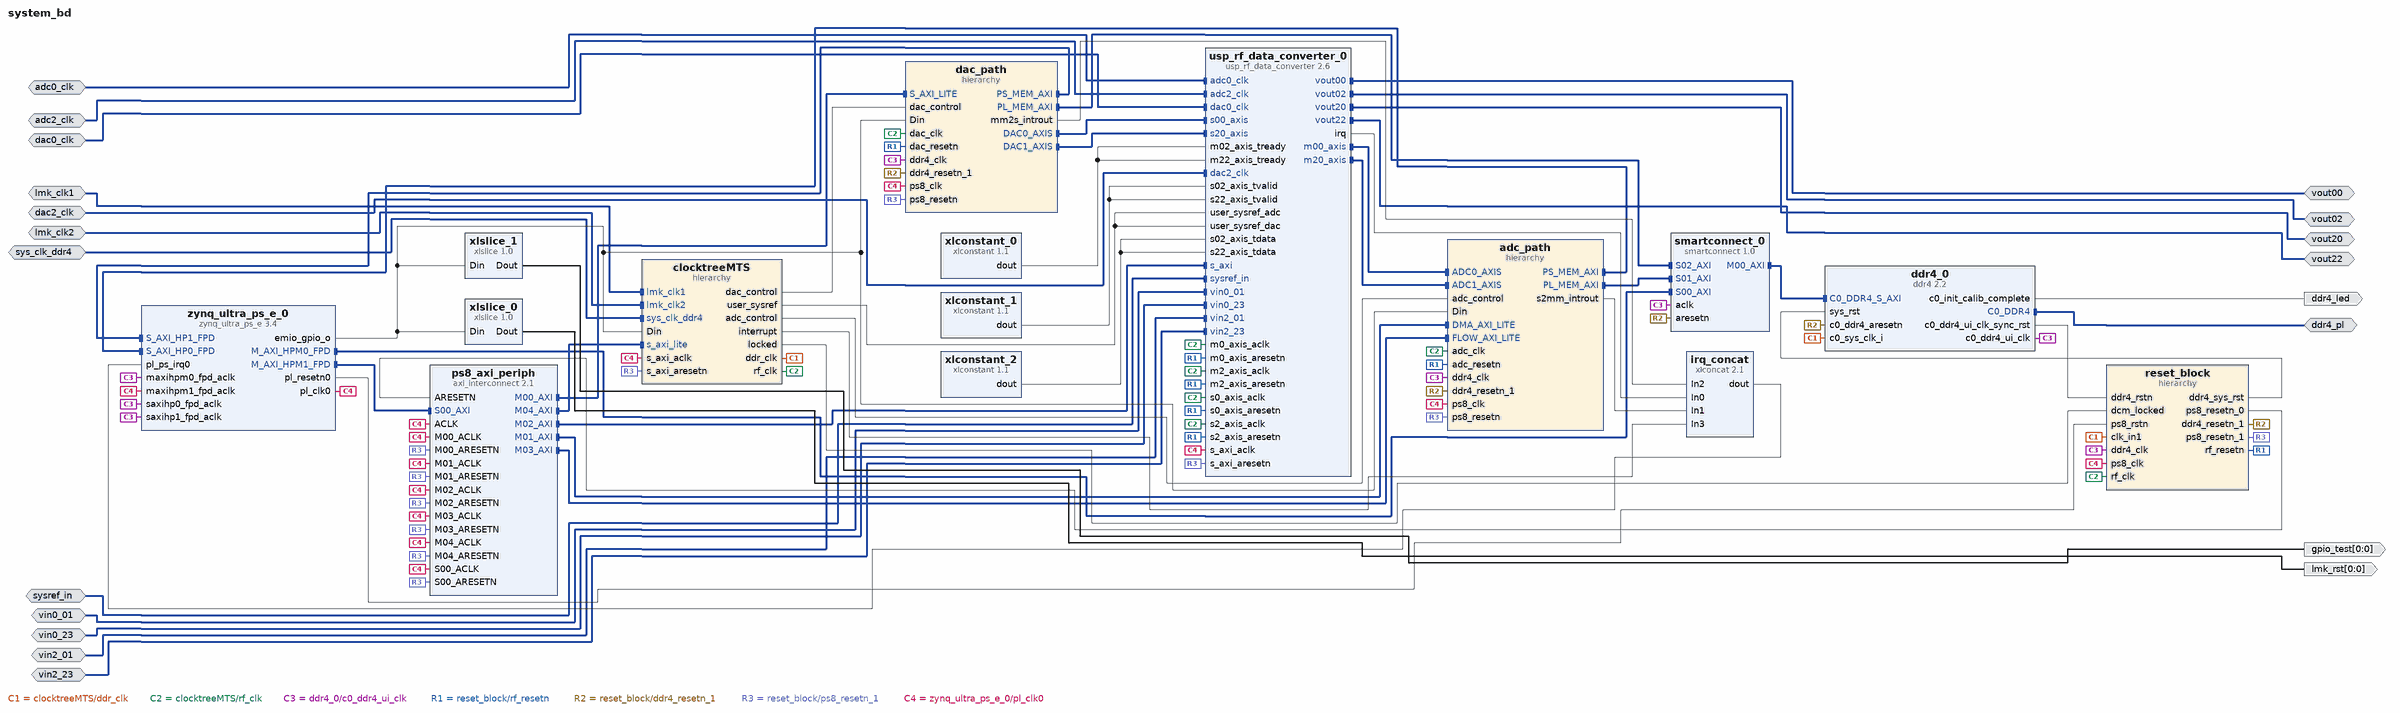
[diagram p0: block diagram of the top level]
# Vivado block design system_bd, xczu48dr-ffvg1517-2-e, Vivado 2022.1
create_bd_design system_bd

create_bd_intf_port -mode Master -vlnv xilinx.com:interface:ddr4_rtl:1.0 ddr4_pl
create_bd_intf_port -mode Slave -vlnv xilinx.com:interface:diff_clock_rtl:1.0 lmk_clk1
set_property -dict {CONFIG.FREQ_HZ 122880000} [get_bd_intf_ports lmk_clk1]
create_bd_intf_port -mode Slave -vlnv xilinx.com:interface:diff_clock_rtl:1.0 lmk_clk2
set_property -dict {CONFIG.FREQ_HZ 7680000} [get_bd_intf_ports lmk_clk2]
create_bd_intf_port -mode Slave -vlnv xilinx.com:interface:diff_clock_rtl:1.0 sys_clk_ddr4
set_property -dict {CONFIG.FREQ_HZ 200000000} [get_bd_intf_ports sys_clk_ddr4]
create_bd_intf_port -mode Slave -vlnv xilinx.com:display_usp_rf_data_converter:diff_pins_rtl:1.0 sysref_in
create_bd_intf_port -mode Slave -vlnv xilinx.com:interface:diff_clock_rtl:1.0 adc0_clk
set_property -dict {CONFIG.FREQ_HZ 100000000} [get_bd_intf_ports adc0_clk]
create_bd_intf_port -mode Slave -vlnv xilinx.com:interface:diff_analog_io_rtl:1.0 vin0_01
create_bd_intf_port -mode Slave -vlnv xilinx.com:interface:diff_analog_io_rtl:1.0 vin0_23
create_bd_intf_port -mode Slave -vlnv xilinx.com:interface:diff_clock_rtl:1.0 adc2_clk
set_property -dict {CONFIG.FREQ_HZ 100000000} [get_bd_intf_ports adc2_clk]
create_bd_intf_port -mode Slave -vlnv xilinx.com:interface:diff_analog_io_rtl:1.0 vin2_01
create_bd_intf_port -mode Slave -vlnv xilinx.com:interface:diff_analog_io_rtl:1.0 vin2_23
create_bd_intf_port -mode Slave -vlnv xilinx.com:interface:diff_clock_rtl:1.0 dac0_clk
set_property -dict {CONFIG.FREQ_HZ 100000000} [get_bd_intf_ports dac0_clk]
create_bd_intf_port -mode Master -vlnv xilinx.com:interface:diff_analog_io_rtl:1.0 vout00
create_bd_intf_port -mode Master -vlnv xilinx.com:interface:diff_analog_io_rtl:1.0 vout02
create_bd_intf_port -mode Slave -vlnv xilinx.com:interface:diff_clock_rtl:1.0 dac2_clk
set_property -dict {CONFIG.FREQ_HZ 100000000} [get_bd_intf_ports dac2_clk]
create_bd_intf_port -mode Master -vlnv xilinx.com:interface:diff_analog_io_rtl:1.0 vout20
create_bd_intf_port -mode Master -vlnv xilinx.com:interface:diff_analog_io_rtl:1.0 vout22
create_bd_port -dir O ddr4_led
create_bd_port -dir O -from 0 -to 0 gpio_test
create_bd_port -dir O -from 0 -to 0 lmk_rst

create_bd_cell -type hier adc_path
create_bd_cell -type hier clocktreeMTS
create_bd_cell -type hier dac_path
create_bd_cell -type hier reset_block
create_bd_cell -type ip -vlnv xilinx.com:ip:ddr4:2.2 ddr4_0
set_property -dict [list \
  CONFIG.C0.BANK_GROUP_WIDTH 1 \
  CONFIG.C0.DDR4_AxiAddressWidth 33 \
  CONFIG.C0.DDR4_AxiDataWidth 512 \
  CONFIG.C0.DDR4_CasLatency 17 \
  CONFIG.C0.DDR4_CasWriteLatency 12 \
  CONFIG.C0.DDR4_DataWidth 64 \
  CONFIG.C0.DDR4_InputClockPeriod 4998 \
  CONFIG.C0.DDR4_MemoryPart MT40A1G16RC-062E \
  CONFIG.C0.DDR4_TimePeriod 833 \
  CONFIG.RESET_BOARD_INTERFACE Custom \
  CONFIG.System_Clock No_Buffer \
] [get_bd_cells ddr4_0]
create_bd_cell -type ip -vlnv xilinx.com:ip:xlconcat:2.1 irq_concat
set_property -dict {CONFIG.NUM_PORTS 4 CONFIG.dout_width 4} [get_bd_cells irq_concat]
create_bd_cell -type ip -vlnv xilinx.com:ip:axi_interconnect:2.1 ps8_axi_periph
set_property -dict {CONFIG.NUM_MI 5} [get_bd_cells ps8_axi_periph]
create_bd_cell -type ip -vlnv xilinx.com:ip:smartconnect:1.0 smartconnect_0
set_property -dict {CONFIG.NUM_SI 3} [get_bd_cells smartconnect_0]
create_bd_cell -type ip -vlnv xilinx.com:ip:usp_rf_data_converter:2.6 usp_rf_data_converter_0
set_property -dict [list \
  CONFIG.ADC0_Multi_Tile_Sync true \
  CONFIG.ADC0_Outclk_Freq 245.760 \
  CONFIG.ADC0_Refclk_Freq 3932.160 \
  CONFIG.ADC0_Sampling_Rate 3.93216 \
  CONFIG.ADC2_Multi_Tile_Sync true \
  CONFIG.ADC_Data_Width00 4 \
  CONFIG.ADC_Data_Width02 4 \
  CONFIG.ADC_Data_Width20 4 \
  CONFIG.ADC_Data_Width22 4 \
  CONFIG.ADC_Decimation_Mode00 4 \
  CONFIG.ADC_Decimation_Mode02 4 \
  CONFIG.ADC_Decimation_Mode20 4 \
  CONFIG.ADC_Decimation_Mode22 4 \
  CONFIG.ADC_Mixer_Type02 1 \
  CONFIG.ADC_Mixer_Type20 1 \
  CONFIG.ADC_Mixer_Type22 1 \
  CONFIG.ADC_OBS22 false \
  CONFIG.ADC_Slice02_Enable true \
  CONFIG.ADC_Slice20_Enable true \
  CONFIG.ADC_Slice22_Enable true \
  CONFIG.DAC0_Multi_Tile_Sync true \
  CONFIG.DAC2_Multi_Tile_Sync true \
  CONFIG.DAC2_Outclk_Freq 245.760 \
  CONFIG.DAC2_Refclk_Freq 3932.160 \
  CONFIG.DAC2_Sampling_Rate 3.93216 \
  CONFIG.DAC_Coarse_Mixer_Freq20 3 \
  CONFIG.DAC_Coarse_Mixer_Freq22 3 \
  CONFIG.DAC_Data_Width00 4 \
  CONFIG.DAC_Data_Width02 4 \
  CONFIG.DAC_Data_Width20 4 \
  CONFIG.DAC_Data_Width22 4 \
  CONFIG.DAC_Interpolation_Mode00 4 \
  CONFIG.DAC_Interpolation_Mode02 4 \
  CONFIG.DAC_Interpolation_Mode20 4 \
  CONFIG.DAC_Interpolation_Mode22 4 \
  CONFIG.DAC_Mixer_Type00 1 \
  CONFIG.DAC_Mixer_Type02 1 \
  CONFIG.DAC_Mixer_Type20 1 \
  CONFIG.DAC_Mixer_Type22 1 \
  CONFIG.DAC_Slice00_Enable true \
  CONFIG.DAC_Slice02_Enable true \
  CONFIG.DAC_Slice20_Enable true \
  CONFIG.DAC_Slice22_Enable true \
] [get_bd_cells usp_rf_data_converter_0]
create_bd_cell -type ip -vlnv xilinx.com:ip:xlconstant:1.1 xlconstant_0
create_bd_cell -type ip -vlnv xilinx.com:ip:xlconstant:1.1 xlconstant_1
create_bd_cell -type ip -vlnv xilinx.com:ip:xlconstant:1.1 xlconstant_2
set_property -dict {CONFIG.CONST_VAL 0 CONFIG.CONST_WIDTH 64} [get_bd_cells xlconstant_2]
create_bd_cell -type ip -vlnv xilinx.com:ip:xlslice:1.0 xlslice_0
set_property -dict {CONFIG.DIN_FROM 84 CONFIG.DIN_TO 84 CONFIG.DIN_WIDTH 95 CONFIG.DOUT_WIDTH 1} [get_bd_cells xlslice_0]
create_bd_cell -type ip -vlnv xilinx.com:ip:xlslice:1.0 xlslice_1
set_property -dict {CONFIG.DIN_FROM 80 CONFIG.DIN_TO 80 CONFIG.DIN_WIDTH 95 CONFIG.DOUT_WIDTH 1} [get_bd_cells xlslice_1]
create_bd_cell -type ip -vlnv xilinx.com:ip:zynq_ultra_ps_e:3.4 zynq_ultra_ps_e_0
set_property -dict [list \
  CONFIG.CAN0_BOARD_INTERFACE custom \
  CONFIG.CAN1_BOARD_INTERFACE custom \
  CONFIG.CSU_BOARD_INTERFACE custom \
  CONFIG.DP_BOARD_INTERFACE custom \
  CONFIG.GEM0_BOARD_INTERFACE custom \
  CONFIG.GEM1_BOARD_INTERFACE custom \
  CONFIG.GEM2_BOARD_INTERFACE custom \
  CONFIG.GEM3_BOARD_INTERFACE custom \
  CONFIG.GPIO_BOARD_INTERFACE custom \
  CONFIG.IIC0_BOARD_INTERFACE custom \
  CONFIG.IIC1_BOARD_INTERFACE custom \
  CONFIG.NAND_BOARD_INTERFACE custom \
  CONFIG.PCIE_BOARD_INTERFACE custom \
  CONFIG.PJTAG_BOARD_INTERFACE custom \
  CONFIG.PMU_BOARD_INTERFACE custom \
  CONFIG.PSU_BANK_0_IO_STANDARD LVCMOS33 \
  CONFIG.PSU_BANK_1_IO_STANDARD LVCMOS18 \
  CONFIG.PSU_BANK_2_IO_STANDARD LVCMOS18 \
  CONFIG.PSU_BANK_3_IO_STANDARD LVCMOS18 \
  CONFIG.PSU_USB3__DUAL_CLOCK_ENABLE 1 \
  CONFIG.PSU__CAN1__PERIPHERAL__ENABLE 0 \
  CONFIG.PSU__CRF_APB__ACPU_CTRL__FREQMHZ 1200 \
  CONFIG.PSU__CRF_APB__ACPU_CTRL__SRCSEL APLL \
  CONFIG.PSU__CRF_APB__APLL_CTRL__SRCSEL PSS_REF_CLK \
  CONFIG.PSU__CRF_APB__DBG_FPD_CTRL__FREQMHZ 250 \
  CONFIG.PSU__CRF_APB__DBG_FPD_CTRL__SRCSEL IOPLL \
  CONFIG.PSU__CRF_APB__DBG_TRACE_CTRL__FREQMHZ 250 \
  CONFIG.PSU__CRF_APB__DBG_TRACE_CTRL__SRCSEL IOPLL \
  CONFIG.PSU__CRF_APB__DBG_TSTMP_CTRL__FREQMHZ 250 \
  CONFIG.PSU__CRF_APB__DBG_TSTMP_CTRL__SRCSEL IOPLL \
  CONFIG.PSU__CRF_APB__DDR_CTRL__FREQMHZ 1200 \
  CONFIG.PSU__CRF_APB__DDR_CTRL__SRCSEL DPLL \
  CONFIG.PSU__CRF_APB__DPDMA_REF_CTRL__FREQMHZ 600 \
  CONFIG.PSU__CRF_APB__DPDMA_REF_CTRL__SRCSEL DPLL \
  CONFIG.PSU__CRF_APB__DPLL_CTRL__SRCSEL PSS_REF_CLK \
  CONFIG.PSU__CRF_APB__DP_AUDIO_REF_CTRL__SRCSEL VPLL \
  CONFIG.PSU__CRF_APB__DP_STC_REF_CTRL__SRCSEL VPLL \
  CONFIG.PSU__CRF_APB__DP_VIDEO_REF_CTRL__SRCSEL DPLL \
  CONFIG.PSU__CRF_APB__GDMA_REF_CTRL__FREQMHZ 600 \
  CONFIG.PSU__CRF_APB__GDMA_REF_CTRL__SRCSEL DPLL \
  CONFIG.PSU__CRF_APB__GPU_REF_CTRL__FREQMHZ 600 \
  CONFIG.PSU__CRF_APB__GPU_REF_CTRL__SRCSEL DPLL \
  CONFIG.PSU__CRF_APB__TOPSW_LSBUS_CTRL__FREQMHZ 100 \
  CONFIG.PSU__CRF_APB__TOPSW_LSBUS_CTRL__SRCSEL IOPLL \
  CONFIG.PSU__CRF_APB__TOPSW_MAIN_CTRL__FREQMHZ 533.333 \
  CONFIG.PSU__CRF_APB__TOPSW_MAIN_CTRL__SRCSEL VPLL \
  CONFIG.PSU__CRF_APB__VPLL_CTRL__SRCSEL PSS_REF_CLK \
  CONFIG.PSU__CRL_APB__ADMA_REF_CTRL__FREQMHZ 533.333 \
  CONFIG.PSU__CRL_APB__ADMA_REF_CTRL__SRCSEL RPLL \
  CONFIG.PSU__CRL_APB__CAN1_REF_CTRL__FREQMHZ 100 \
  CONFIG.PSU__CRL_APB__CAN1_REF_CTRL__SRCSEL IOPLL \
  CONFIG.PSU__CRL_APB__CPU_R5_CTRL__FREQMHZ 500 \
  CONFIG.PSU__CRL_APB__CPU_R5_CTRL__SRCSEL IOPLL \
  CONFIG.PSU__CRL_APB__DBG_LPD_CTRL__FREQMHZ 250 \
  CONFIG.PSU__CRL_APB__DBG_LPD_CTRL__SRCSEL IOPLL \
  CONFIG.PSU__CRL_APB__GEM3_REF_CTRL__FREQMHZ 125 \
  CONFIG.PSU__CRL_APB__GEM3_REF_CTRL__SRCSEL IOPLL \
  CONFIG.PSU__CRL_APB__I2C0_REF_CTRL__FREQMHZ 100 \
  CONFIG.PSU__CRL_APB__I2C0_REF_CTRL__SRCSEL IOPLL \
  CONFIG.PSU__CRL_APB__I2C1_REF_CTRL__FREQMHZ 100 \
  CONFIG.PSU__CRL_APB__I2C1_REF_CTRL__SRCSEL IOPLL \
  CONFIG.PSU__CRL_APB__IOPLL_CTRL__SRCSEL PSS_REF_CLK \
  CONFIG.PSU__CRL_APB__IOU_SWITCH_CTRL__FREQMHZ 267 \
  CONFIG.PSU__CRL_APB__IOU_SWITCH_CTRL__SRCSEL RPLL \
  CONFIG.PSU__CRL_APB__LPD_LSBUS_CTRL__FREQMHZ 100 \
  CONFIG.PSU__CRL_APB__LPD_LSBUS_CTRL__SRCSEL IOPLL \
  CONFIG.PSU__CRL_APB__LPD_SWITCH_CTRL__FREQMHZ 533.333 \
  CONFIG.PSU__CRL_APB__LPD_SWITCH_CTRL__SRCSEL RPLL \
  CONFIG.PSU__CRL_APB__PCAP_CTRL__FREQMHZ 200 \
  CONFIG.PSU__CRL_APB__PCAP_CTRL__SRCSEL IOPLL \
  CONFIG.PSU__CRL_APB__PL0_REF_CTRL__FREQMHZ 100 \
  CONFIG.PSU__CRL_APB__PL0_REF_CTRL__SRCSEL IOPLL \
  CONFIG.PSU__CRL_APB__QSPI_REF_CTRL__FREQMHZ 300 \
  CONFIG.PSU__CRL_APB__QSPI_REF_CTRL__SRCSEL IOPLL \
  CONFIG.PSU__CRL_APB__RPLL_CTRL__SRCSEL PSS_REF_CLK \
  CONFIG.PSU__CRL_APB__SDIO1_REF_CTRL__FREQMHZ 200 \
  CONFIG.PSU__CRL_APB__SDIO1_REF_CTRL__SRCSEL IOPLL \
  CONFIG.PSU__CRL_APB__TIMESTAMP_REF_CTRL__FREQMHZ 100 \
  CONFIG.PSU__CRL_APB__TIMESTAMP_REF_CTRL__SRCSEL PSS_REF_CLK \
  CONFIG.PSU__CRL_APB__UART0_REF_CTRL__FREQMHZ 100 \
  CONFIG.PSU__CRL_APB__UART0_REF_CTRL__SRCSEL IOPLL \
  CONFIG.PSU__CRL_APB__UART1_REF_CTRL__FREQMHZ 100 \
  CONFIG.PSU__CRL_APB__UART1_REF_CTRL__SRCSEL IOPLL \
  CONFIG.PSU__CRL_APB__USB0_BUS_REF_CTRL__FREQMHZ 250 \
  CONFIG.PSU__CRL_APB__USB0_BUS_REF_CTRL__SRCSEL IOPLL \
  CONFIG.PSU__CRL_APB__USB3_DUAL_REF_CTRL__FREQMHZ 20 \
  CONFIG.PSU__CRL_APB__USB3_DUAL_REF_CTRL__SRCSEL IOPLL \
  CONFIG.PSU__CRL_APB__USB3__ENABLE 1 \
  CONFIG.PSU__CSUPMU__PERIPHERAL__VALID 0 \
  CONFIG.PSU__DDRC__BUS_WIDTH {64 Bit} \
  CONFIG.PSU__DDRC__COMPONENTS Components \
  CONFIG.PSU__DDRC__DEVICE_CAPACITY {16384 MBits} \
  CONFIG.PSU__DDRC__DRAM_WIDTH {16 Bits} \
  CONFIG.PSU__DDRC__ECC Disabled \
  CONFIG.PSU__DDRC__MEMORY_TYPE {DDR 4} \
  CONFIG.PSU__DDRC__SPEED_BIN DDR4_2400R \
  CONFIG.PSU__DDR_HIGH_ADDRESS_GUI_ENABLE 1 \
  CONFIG.PSU__DDR__INTERFACE__FREQMHZ 600.000 \
  CONFIG.PSU__DEVICE_TYPE RFSOC \
  CONFIG.PSU__DISPLAYPORT__PERIPHERAL__ENABLE 0 \
  CONFIG.PSU__DLL__ISUSED 1 \
  CONFIG.PSU__ENET0__GRP_MDIO__ENABLE 1 \
  CONFIG.PSU__ENET0__GRP_MDIO__IO {MIO 76 .. 77} \
  CONFIG.PSU__ENET0__PERIPHERAL__ENABLE 1 \
  CONFIG.PSU__ENET0__PERIPHERAL__IO {MIO 26 .. 37} \
  CONFIG.PSU__ENET3__PERIPHERAL__ENABLE 0 \
  CONFIG.PSU__FPD_SLCR__WDT1__FREQMHZ 100 \
  CONFIG.PSU__FPGA_PL0_ENABLE 1 \
  CONFIG.PSU__GEM__TSU__ENABLE 0 \
  CONFIG.PSU__GPIO0_MIO__IO {MIO 0 .. 25} \
  CONFIG.PSU__GPIO0_MIO__PERIPHERAL__ENABLE 1 \
  CONFIG.PSU__GPIO1_MIO__IO {MIO 26 .. 51} \
  CONFIG.PSU__GPIO1_MIO__PERIPHERAL__ENABLE 1 \
  CONFIG.PSU__GPIO_EMIO_WIDTH 95 \
  CONFIG.PSU__GPIO_EMIO__PERIPHERAL__ENABLE 1 \
  CONFIG.PSU__GPIO_EMIO__PERIPHERAL__IO 95 \
  CONFIG.PSU__GPU_PP0__POWER__ON 0 \
  CONFIG.PSU__GPU_PP1__POWER__ON 0 \
  CONFIG.PSU__I2C0__PERIPHERAL__ENABLE 1 \
  CONFIG.PSU__I2C0__PERIPHERAL__IO {MIO 14 .. 15} \
  CONFIG.PSU__I2C1__PERIPHERAL__ENABLE 1 \
  CONFIG.PSU__I2C1__PERIPHERAL__IO {MIO 16 .. 17} \
  CONFIG.PSU__IOU_SLCR__IOU_TTC_APB_CLK__TTC0_SEL APB \
  CONFIG.PSU__IOU_SLCR__IOU_TTC_APB_CLK__TTC1_SEL APB \
  CONFIG.PSU__IOU_SLCR__IOU_TTC_APB_CLK__TTC2_SEL APB \
  CONFIG.PSU__IOU_SLCR__IOU_TTC_APB_CLK__TTC3_SEL APB \
  CONFIG.PSU__IOU_SLCR__TTC0__FREQMHZ 100 \
  CONFIG.PSU__IOU_SLCR__TTC1__FREQMHZ 100 \
  CONFIG.PSU__IOU_SLCR__TTC2__FREQMHZ 100 \
  CONFIG.PSU__IOU_SLCR__TTC3__FREQMHZ 100 \
  CONFIG.PSU__IOU_SLCR__WDT0__FREQMHZ 100 \
  CONFIG.PSU__LPD_SLCR__CSUPMU__FREQMHZ 100 \
  CONFIG.PSU__MAXIGP0__DATA_WIDTH 128 \
  CONFIG.PSU__OVERRIDE_HPX_QOS 0 \
  CONFIG.PSU__OVERRIDE__BASIC_CLOCK 0 \
  CONFIG.PSU__PMU__PERIPHERAL__ENABLE 0 \
  CONFIG.PSU__PRESET_APPLIED 0 \
  CONFIG.PSU__PSS_REF_CLK__FREQMHZ 33.333 \
  CONFIG.PSU__QSPI_COHERENCY 0 \
  CONFIG.PSU__QSPI_ROUTE_THROUGH_FPD 0 \
  CONFIG.PSU__QSPI__GRP_FBCLK__ENABLE 0 \
  CONFIG.PSU__QSPI__PERIPHERAL__DATA_MODE x1 \
  CONFIG.PSU__QSPI__PERIPHERAL__ENABLE 1 \
  CONFIG.PSU__QSPI__PERIPHERAL__IO {MIO 0 .. 5} \
  CONFIG.PSU__QSPI__PERIPHERAL__MODE Single \
  CONFIG.PSU__SATA__PERIPHERAL__ENABLE 0 \
  CONFIG.PSU__SD0__CLK_100_SDR_OTAP_DLY 0x3 \
  CONFIG.PSU__SD0__CLK_200_SDR_OTAP_DLY 0x3 \
  CONFIG.PSU__SD0__CLK_50_DDR_ITAP_DLY 0x3D \
  CONFIG.PSU__SD0__CLK_50_DDR_OTAP_DLY 0x4 \
  CONFIG.PSU__SD0__CLK_50_SDR_ITAP_DLY 0x15 \
  CONFIG.PSU__SD0__CLK_50_SDR_OTAP_DLY 0x5 \
  CONFIG.PSU__SD1_COHERENCY 0 \
  CONFIG.PSU__SD1_ROUTE_THROUGH_FPD 0 \
  CONFIG.PSU__SD1__CLK_100_SDR_OTAP_DLY 0x3 \
  CONFIG.PSU__SD1__CLK_200_SDR_OTAP_DLY 0x3 \
  CONFIG.PSU__SD1__CLK_50_DDR_ITAP_DLY 0x3D \
  CONFIG.PSU__SD1__CLK_50_DDR_OTAP_DLY 0x4 \
  CONFIG.PSU__SD1__CLK_50_SDR_ITAP_DLY 0x15 \
  CONFIG.PSU__SD1__CLK_50_SDR_OTAP_DLY 0x5 \
  CONFIG.PSU__SD1__DATA_TRANSFER_MODE 8Bit \
  CONFIG.PSU__SD1__GRP_CD__ENABLE 1 \
  CONFIG.PSU__SD1__GRP_CD__IO {MIO 45} \
  CONFIG.PSU__SD1__GRP_POW__ENABLE 0 \
  CONFIG.PSU__SD1__GRP_WP__ENABLE 1 \
  CONFIG.PSU__SD1__GRP_WP__IO {MIO 44} \
  CONFIG.PSU__SD1__PERIPHERAL__ENABLE 1 \
  CONFIG.PSU__SD1__PERIPHERAL__IO {MIO 39 .. 51} \
  CONFIG.PSU__SD1__SLOT_TYPE {SD 3.0} \
  CONFIG.PSU__SWDT0__PERIPHERAL__ENABLE 0 \
  CONFIG.PSU__SWDT1__PERIPHERAL__ENABLE 0 \
  CONFIG.PSU__TSU__BUFG_PORT_PAIR 0 \
  CONFIG.PSU__TTC0__PERIPHERAL__ENABLE 0 \
  CONFIG.PSU__TTC1__PERIPHERAL__ENABLE 0 \
  CONFIG.PSU__TTC2__PERIPHERAL__ENABLE 0 \
  CONFIG.PSU__TTC3__PERIPHERAL__ENABLE 0 \
  CONFIG.PSU__UART0__BAUD_RATE 115200 \
  CONFIG.PSU__UART0__MODEM__ENABLE 0 \
  CONFIG.PSU__UART0__PERIPHERAL__ENABLE 1 \
  CONFIG.PSU__UART0__PERIPHERAL__IO {MIO 18 .. 19} \
  CONFIG.PSU__UART1__PERIPHERAL__ENABLE 0 \
  CONFIG.PSU__USB0_COHERENCY 0 \
  CONFIG.PSU__USB0__PERIPHERAL__ENABLE 1 \
  CONFIG.PSU__USB0__PERIPHERAL__IO {MIO 52 .. 63} \
  CONFIG.PSU__USB0__REF_CLK_FREQ 100 \
  CONFIG.PSU__USB0__REF_CLK_SEL {Ref Clk3} \
  CONFIG.PSU__USB0__RESET__ENABLE 1 \
  CONFIG.PSU__USB0__RESET__IO {MIO 8} \
  CONFIG.PSU__USB1__PERIPHERAL__ENABLE 1 \
  CONFIG.PSU__USB1__PERIPHERAL__IO {MIO 64 .. 75} \
  CONFIG.PSU__USB1__REF_CLK_FREQ 100 \
  CONFIG.PSU__USB1__REF_CLK_SEL {Ref Clk3} \
  CONFIG.PSU__USB2_0__EMIO__ENABLE 0 \
  CONFIG.PSU__USB3_0__EMIO__ENABLE 0 \
  CONFIG.PSU__USB3_0__PERIPHERAL__ENABLE 1 \
  CONFIG.PSU__USB3_0__PERIPHERAL__IO {GT Lane0} \
  CONFIG.PSU__USB3_1__PERIPHERAL__ENABLE 1 \
  CONFIG.PSU__USB3_1__PERIPHERAL__IO {GT Lane3} \
  CONFIG.PSU__USB__RESET__MODE {Shared MIO Pin} \
  CONFIG.PSU__USB__RESET__POLARITY {Active Low} \
  CONFIG.PSU__USE__IRQ0 1 \
  CONFIG.PSU__USE__M_AXI_GP0 1 \
  CONFIG.PSU__USE__M_AXI_GP1 1 \
  CONFIG.PSU__USE__M_AXI_GP2 0 \
  CONFIG.PSU__USE__S_AXI_GP2 1 \
  CONFIG.PSU__USE__S_AXI_GP3 1 \
  CONFIG.QSPI_BOARD_INTERFACE custom \
  CONFIG.SATA_BOARD_INTERFACE custom \
  CONFIG.SD0_BOARD_INTERFACE custom \
  CONFIG.SD1_BOARD_INTERFACE custom \
  CONFIG.SPI0_BOARD_INTERFACE custom \
  CONFIG.SPI1_BOARD_INTERFACE custom \
  CONFIG.SUBPRESET1 Custom \
  CONFIG.SUBPRESET2 Custom \
  CONFIG.SWDT0_BOARD_INTERFACE custom \
  CONFIG.SWDT1_BOARD_INTERFACE custom \
  CONFIG.TRACE_BOARD_INTERFACE custom \
  CONFIG.TTC0_BOARD_INTERFACE custom \
  CONFIG.TTC1_BOARD_INTERFACE custom \
  CONFIG.TTC2_BOARD_INTERFACE custom \
  CONFIG.TTC3_BOARD_INTERFACE custom \
  CONFIG.UART0_BOARD_INTERFACE custom \
  CONFIG.UART1_BOARD_INTERFACE custom \
  CONFIG.USB0_BOARD_INTERFACE custom \
  CONFIG.USB1_BOARD_INTERFACE custom \
] [get_bd_cells zynq_ultra_ps_e_0]
# 727 more settings of zynq_ultra_ps_e_0 are not shown: defaults, MIO pin electricals, DDR timing, and values the tool derives

# ---- hierarchy /adc_path ----
current_bd_instance /adc_path
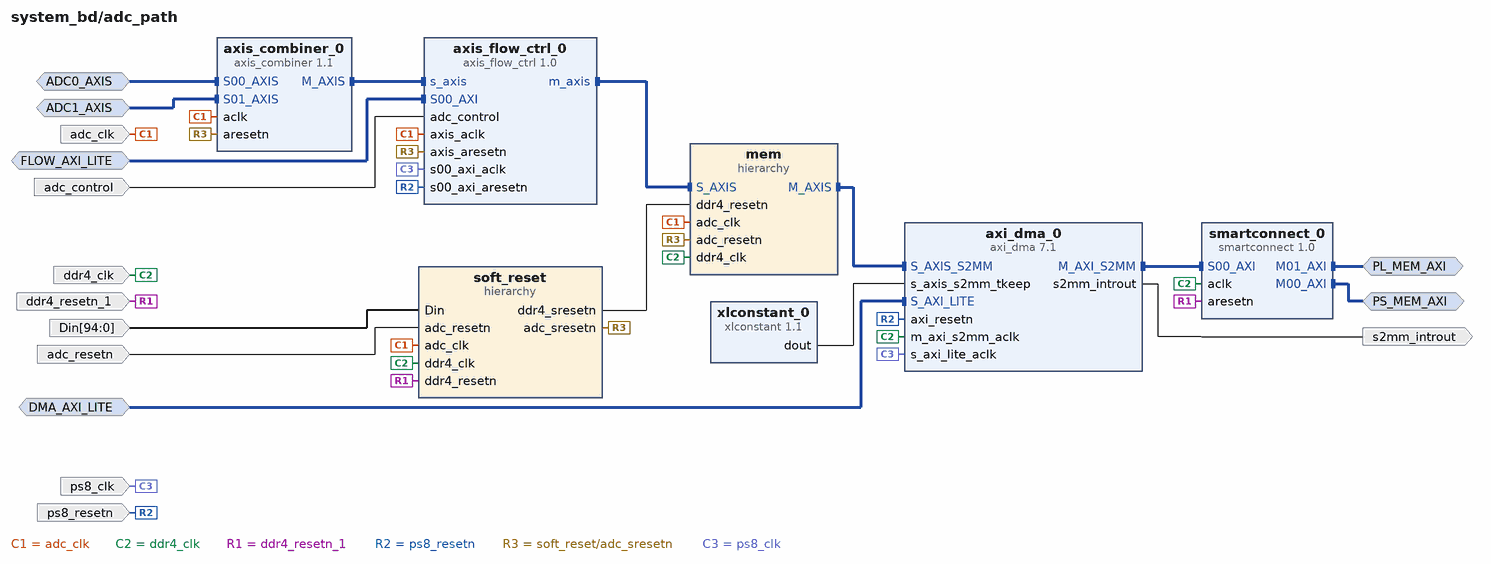
[diagram p1: block diagram inside /adc_path]
create_bd_intf_pin -mode Slave -vlnv xilinx.com:interface:axis_rtl:1.0 ADC0_AXIS
create_bd_intf_pin -mode Slave -vlnv xilinx.com:interface:axis_rtl:1.0 ADC1_AXIS
create_bd_intf_pin -mode Slave -vlnv xilinx.com:interface:aximm_rtl:1.0 DMA_AXI_LITE
create_bd_intf_pin -mode Slave -vlnv xilinx.com:interface:aximm_rtl:1.0 FLOW_AXI_LITE
create_bd_intf_pin -mode Master -vlnv xilinx.com:interface:aximm_rtl:1.0 PL_MEM_AXI
create_bd_intf_pin -mode Master -vlnv xilinx.com:interface:aximm_rtl:1.0 PS_MEM_AXI
create_bd_pin -dir I -from 94 -to 0 Din
create_bd_pin -dir I -type clk adc_clk
create_bd_pin -dir I adc_control
create_bd_pin -dir I -type rst adc_resetn
create_bd_pin -dir I -type clk ddr4_clk
create_bd_pin -dir I -type rst ddr4_resetn_1
create_bd_pin -dir I -type clk ps8_clk
create_bd_pin -dir I -type rst ps8_resetn
create_bd_pin -dir O -type intr s2mm_introut

create_bd_cell -type hier mem
create_bd_cell -type hier soft_reset
create_bd_cell -type ip -vlnv xilinx.com:ip:axi_dma:7.1 axi_dma_0
set_property -dict [list \
  CONFIG.c_addr_width 64 \
  CONFIG.c_include_mm2s 0 \
  CONFIG.c_include_s2mm 1 \
  CONFIG.c_include_s2mm_dre 0 \
  CONFIG.c_include_sg 0 \
  CONFIG.c_m_axi_s2mm_data_width 256 \
  CONFIG.c_s2mm_burst_size 128 \
  CONFIG.c_s_axis_s2mm_tdata_width 128 \
  CONFIG.c_sg_length_width 26 \
] [get_bd_cells axi_dma_0]
create_bd_cell -type ip -vlnv xilinx.com:ip:axis_combiner:1.1 axis_combiner_0
create_bd_cell -type ip -vlnv user.org:user:axis_flow_ctrl:1.0 axis_flow_ctrl_0
set_property -dict {CONFIG.C_AXIS_DWIDTH 128} [get_bd_cells axis_flow_ctrl_0]
create_bd_cell -type ip -vlnv xilinx.com:ip:smartconnect:1.0 smartconnect_0
set_property -dict {CONFIG.NUM_MI 2 CONFIG.NUM_SI 1} [get_bd_cells smartconnect_0]
create_bd_cell -type ip -vlnv xilinx.com:ip:xlconstant:1.1 xlconstant_0
set_property -dict {CONFIG.CONST_VAL 0xFFFF CONFIG.CONST_WIDTH 16} [get_bd_cells xlconstant_0]

# ---- hierarchy /adc_path/mem ----
current_bd_instance /adc_path/mem
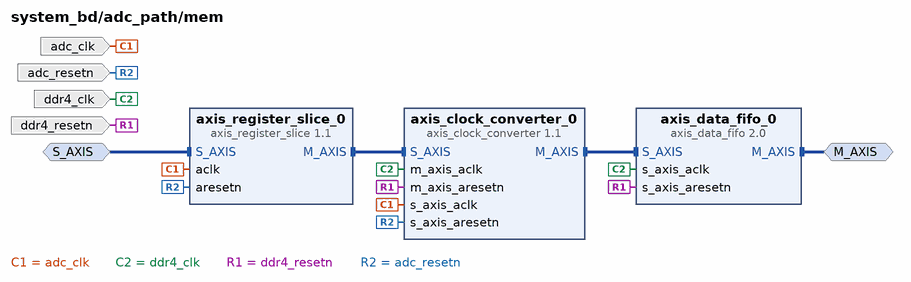
[diagram p2: block diagram inside /adc_path/mem]
create_bd_intf_pin -mode Master -vlnv xilinx.com:interface:axis_rtl:1.0 M_AXIS
create_bd_intf_pin -mode Slave -vlnv xilinx.com:interface:axis_rtl:1.0 S_AXIS
create_bd_pin -dir I -type clk adc_clk
create_bd_pin -dir I -type rst adc_resetn
create_bd_pin -dir I -type clk ddr4_clk
create_bd_pin -dir I -type rst ddr4_resetn

create_bd_cell -type ip -vlnv xilinx.com:ip:axis_clock_converter:1.1 axis_clock_converter_0
create_bd_cell -type ip -vlnv xilinx.com:ip:axis_data_fifo:2.0 axis_data_fifo_0
set_property -dict {CONFIG.FIFO_DEPTH 32768 CONFIG.IS_ACLK_ASYNC 0} [get_bd_cells axis_data_fifo_0]
create_bd_cell -type ip -vlnv xilinx.com:ip:axis_register_slice:1.1 axis_register_slice_0

# ---- hierarchy /adc_path/soft_reset ----
current_bd_instance /adc_path/soft_reset
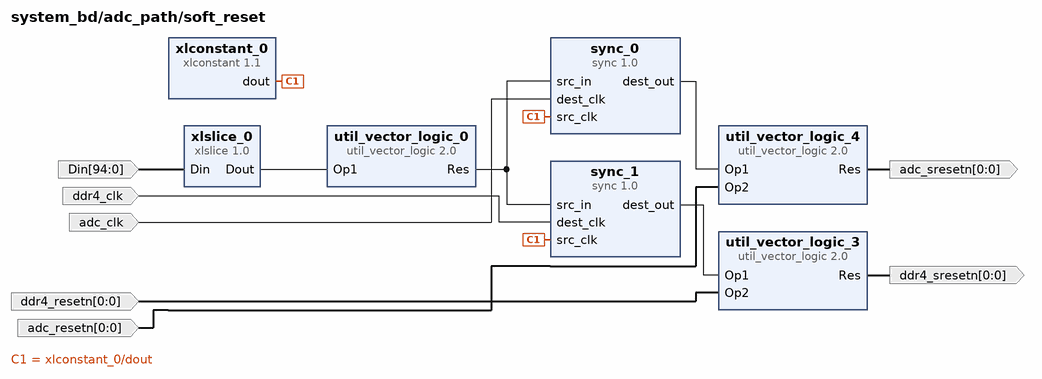
[diagram p3: block diagram inside /adc_path/soft_reset]
create_bd_pin -dir I -from 94 -to 0 Din
create_bd_pin -dir I -type clk adc_clk
create_bd_pin -dir I -from 0 -to 0 -type rst adc_resetn
create_bd_pin -dir O -from 0 -to 0 adc_sresetn
create_bd_pin -dir I -type clk ddr4_clk
create_bd_pin -dir I -from 0 -to 0 ddr4_resetn
create_bd_pin -dir O -from 0 -to 0 ddr4_sresetn

create_bd_cell -type ip -vlnv xilinx.com:user:sync:1.0 sync_0
set_property -dict {CONFIG.SRC_INPUT_REG 0} [get_bd_cells sync_0]
create_bd_cell -type ip -vlnv xilinx.com:user:sync:1.0 sync_1
set_property -dict {CONFIG.SRC_INPUT_REG 0} [get_bd_cells sync_1]
create_bd_cell -type ip -vlnv xilinx.com:ip:util_vector_logic:2.0 util_vector_logic_0
set_property -dict {CONFIG.C_OPERATION not CONFIG.C_SIZE 1} [get_bd_cells util_vector_logic_0]
create_bd_cell -type ip -vlnv xilinx.com:ip:util_vector_logic:2.0 util_vector_logic_3
set_property -dict {CONFIG.C_SIZE 1} [get_bd_cells util_vector_logic_3]
create_bd_cell -type ip -vlnv xilinx.com:ip:util_vector_logic:2.0 util_vector_logic_4
set_property -dict {CONFIG.C_SIZE 1} [get_bd_cells util_vector_logic_4]
create_bd_cell -type ip -vlnv xilinx.com:ip:xlconstant:1.1 xlconstant_0
set_property -dict {CONFIG.CONST_VAL 0} [get_bd_cells xlconstant_0]
create_bd_cell -type ip -vlnv xilinx.com:ip:xlslice:1.0 xlslice_0
set_property -dict {CONFIG.DIN_FROM 32 CONFIG.DIN_TO 32 CONFIG.DIN_WIDTH 95 CONFIG.DOUT_WIDTH 1} [get_bd_cells xlslice_0]

# ---- hierarchy /clocktreeMTS ----
current_bd_instance /clocktreeMTS
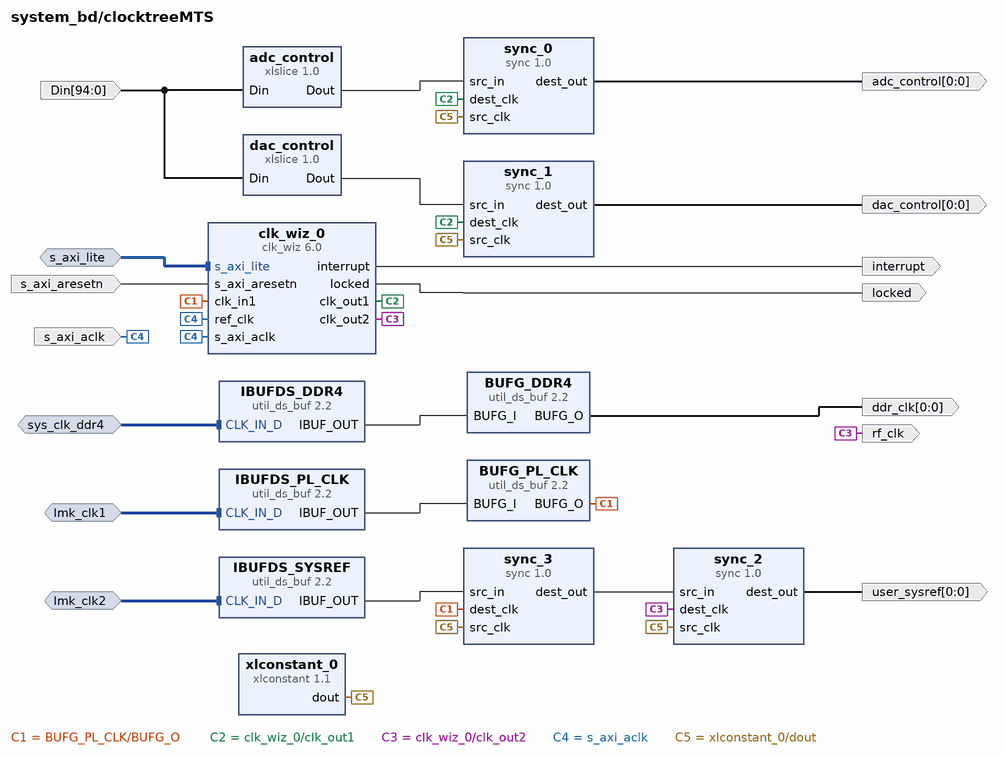
[diagram p4: block diagram inside /clocktreeMTS]
create_bd_intf_pin -mode Slave -vlnv xilinx.com:interface:diff_clock_rtl:1.0 lmk_clk1
create_bd_intf_pin -mode Slave -vlnv xilinx.com:interface:diff_clock_rtl:1.0 lmk_clk2
create_bd_intf_pin -mode Slave -vlnv xilinx.com:interface:aximm_rtl:1.0 s_axi_lite
create_bd_intf_pin -mode Slave -vlnv xilinx.com:interface:diff_clock_rtl:1.0 sys_clk_ddr4
create_bd_pin -dir I -from 94 -to 0 Din
create_bd_pin -dir O -from 0 -to 0 adc_control
create_bd_pin -dir O -from 0 -to 0 dac_control
create_bd_pin -dir O -from 0 -to 0 -type clk ddr_clk
create_bd_pin -dir O -type intr interrupt
create_bd_pin -dir O locked
create_bd_pin -dir O -type clk rf_clk
create_bd_pin -dir I -type clk s_axi_aclk
create_bd_pin -dir I -type rst s_axi_aresetn
create_bd_pin -dir O -from 0 -to 0 user_sysref

create_bd_cell -type ip -vlnv xilinx.com:ip:util_ds_buf:2.2 BUFG_DDR4
set_property -dict {CONFIG.C_BUF_TYPE BUFG} [get_bd_cells BUFG_DDR4]
create_bd_cell -type ip -vlnv xilinx.com:ip:util_ds_buf:2.2 BUFG_PL_CLK
set_property -dict {CONFIG.C_BUF_TYPE BUFG} [get_bd_cells BUFG_PL_CLK]
create_bd_cell -type ip -vlnv xilinx.com:ip:util_ds_buf:2.2 IBUFDS_DDR4
create_bd_cell -type ip -vlnv xilinx.com:ip:util_ds_buf:2.2 IBUFDS_PL_CLK
create_bd_cell -type ip -vlnv xilinx.com:ip:util_ds_buf:2.2 IBUFDS_SYSREF
create_bd_cell -type ip -vlnv xilinx.com:ip:xlslice:1.0 adc_control
set_property -dict {CONFIG.DIN_FROM 34 CONFIG.DIN_TO 34 CONFIG.DIN_WIDTH 95 CONFIG.DOUT_WIDTH 1} [get_bd_cells adc_control]
create_bd_cell -type ip -vlnv xilinx.com:ip:clk_wiz:6.0 clk_wiz_0
set_property -dict [list \
  CONFIG.CLKIN1_JITTER_PS 81.38 \
  CONFIG.CLKIN1_UI_JITTER 0.010 \
  CONFIG.CLKIN2_JITTER_PS 100.0 \
  CONFIG.CLKIN2_UI_JITTER 0.010 \
  CONFIG.CLKOUT1_DRIVES Buffer \
  CONFIG.CLKOUT1_JITTER 82.359 \
  CONFIG.CLKOUT1_PHASE_ERROR 74.849 \
  CONFIG.CLKOUT1_REQUESTED_OUT_FREQ 245.76 \
  CONFIG.CLKOUT1_REQUESTED_PHASE 0 \
  CONFIG.CLKOUT1_USED true \
  CONFIG.CLKOUT2_DRIVES Buffer \
  CONFIG.CLKOUT2_JITTER 82.359 \
  CONFIG.CLKOUT2_PHASE_ERROR 74.849 \
  CONFIG.CLKOUT2_REQUESTED_OUT_FREQ 245.76 \
  CONFIG.CLKOUT2_REQUESTED_PHASE 22.5 \
  CONFIG.CLKOUT2_USED true \
  CONFIG.CLKOUT3_DRIVES Buffer \
  CONFIG.CLKOUT4_DRIVES Buffer \
  CONFIG.CLKOUT5_DRIVES Buffer \
  CONFIG.CLKOUT6_DRIVES Buffer \
  CONFIG.CLKOUT7_DRIVES Buffer \
  CONFIG.ENABLE_CLOCK_MONITOR true \
  CONFIG.JITTER_OPTIONS UI \
  CONFIG.JITTER_SEL Min_O_Jitter \
  CONFIG.MMCM_BANDWIDTH HIGH \
  CONFIG.MMCM_CLKFBOUT_MULT_F 12.000 \
  CONFIG.MMCM_CLKIN1_PERIOD 8.138 \
  CONFIG.MMCM_CLKOUT0_DIVIDE_F 6.000 \
  CONFIG.MMCM_CLKOUT0_PHASE 0.000 \
  CONFIG.MMCM_CLKOUT1_DIVIDE 6 \
  CONFIG.MMCM_CLKOUT1_PHASE 22.500 \
  CONFIG.MMCM_REF_JITTER1 0.010 \
  CONFIG.MMCM_REF_JITTER2 0.010 \
  CONFIG.NUM_OUT_CLKS 2 \
  CONFIG.OPTIMIZE_CLOCKING_STRUCTURE_EN true \
  CONFIG.PRIMITIVE MMCM \
  CONFIG.PRIM_IN_FREQ 122.88 \
  CONFIG.PRIM_SOURCE Global_buffer \
  CONFIG.SECONDARY_SOURCE Single_ended_clock_capable_pin \
  CONFIG.USE_PHASE_ALIGNMENT true \
] [get_bd_cells clk_wiz_0]
create_bd_cell -type ip -vlnv xilinx.com:ip:xlslice:1.0 dac_control
set_property -dict {CONFIG.DIN_FROM 2 CONFIG.DIN_TO 2 CONFIG.DIN_WIDTH 95 CONFIG.DOUT_WIDTH 1} [get_bd_cells dac_control]
create_bd_cell -type ip -vlnv xilinx.com:user:sync:1.0 sync_0
set_property -dict {CONFIG.DEST_SYNC_FF 2 CONFIG.SRC_INPUT_REG 0} [get_bd_cells sync_0]
create_bd_cell -type ip -vlnv xilinx.com:user:sync:1.0 sync_1
set_property -dict {CONFIG.DEST_SYNC_FF 2 CONFIG.SRC_INPUT_REG 0} [get_bd_cells sync_1]
create_bd_cell -type ip -vlnv xilinx.com:user:sync:1.0 sync_2
set_property -dict {CONFIG.DEST_SYNC_FF 2 CONFIG.SRC_INPUT_REG 0} [get_bd_cells sync_2]
create_bd_cell -type ip -vlnv xilinx.com:user:sync:1.0 sync_3
set_property -dict {CONFIG.DEST_SYNC_FF 2 CONFIG.SRC_INPUT_REG 0} [get_bd_cells sync_3]
create_bd_cell -type ip -vlnv xilinx.com:ip:xlconstant:1.1 xlconstant_0
set_property -dict {CONFIG.CONST_VAL 0} [get_bd_cells xlconstant_0]

# ---- hierarchy /dac_path ----
current_bd_instance /dac_path
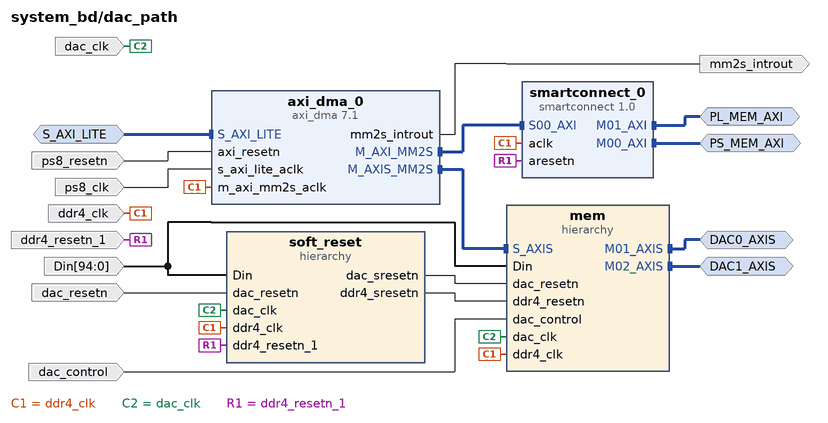
[diagram p5: block diagram inside /dac_path]
create_bd_intf_pin -mode Master -vlnv xilinx.com:interface:axis_rtl:1.0 DAC0_AXIS
create_bd_intf_pin -mode Master -vlnv xilinx.com:interface:axis_rtl:1.0 DAC1_AXIS
create_bd_intf_pin -mode Master -vlnv xilinx.com:interface:aximm_rtl:1.0 PL_MEM_AXI
create_bd_intf_pin -mode Master -vlnv xilinx.com:interface:aximm_rtl:1.0 PS_MEM_AXI
create_bd_intf_pin -mode Slave -vlnv xilinx.com:interface:aximm_rtl:1.0 S_AXI_LITE
create_bd_pin -dir I -from 94 -to 0 Din
create_bd_pin -dir I -type clk dac_clk
create_bd_pin -dir I dac_control
create_bd_pin -dir I dac_resetn
create_bd_pin -dir I -type clk ddr4_clk
create_bd_pin -dir I -type rst ddr4_resetn_1
create_bd_pin -dir O -type intr mm2s_introut
create_bd_pin -dir I -type clk ps8_clk
create_bd_pin -dir I -type rst ps8_resetn

create_bd_cell -type hier mem
create_bd_cell -type hier soft_reset
create_bd_cell -type ip -vlnv xilinx.com:ip:axi_dma:7.1 axi_dma_0
set_property -dict [list \
  CONFIG.c_addr_width 64 \
  CONFIG.c_include_s2mm 0 \
  CONFIG.c_include_sg 0 \
  CONFIG.c_m_axi_mm2s_data_width 256 \
  CONFIG.c_m_axis_mm2s_tdata_width 128 \
  CONFIG.c_mm2s_burst_size 128 \
  CONFIG.c_sg_length_width 26 \
] [get_bd_cells axi_dma_0]
create_bd_cell -type ip -vlnv xilinx.com:ip:smartconnect:1.0 smartconnect_0
set_property -dict {CONFIG.NUM_MI 2 CONFIG.NUM_SI 1} [get_bd_cells smartconnect_0]

# ---- hierarchy /dac_path/mem ----
current_bd_instance /dac_path/mem
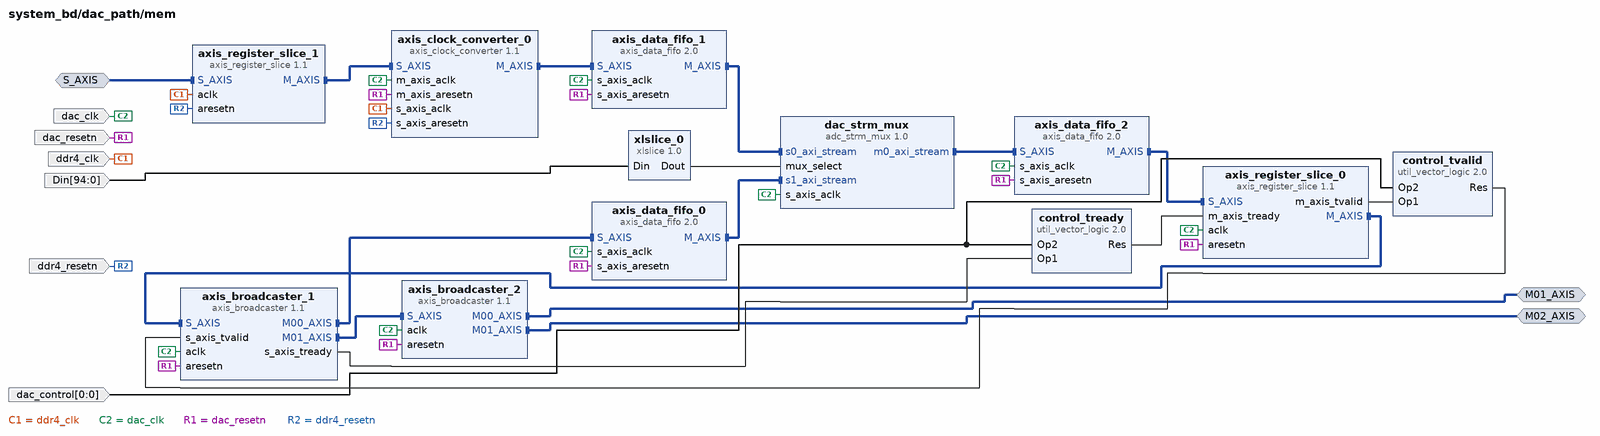
[diagram p6: block diagram inside /dac_path/mem]
create_bd_intf_pin -mode Master -vlnv xilinx.com:interface:axis_rtl:1.0 M01_AXIS
create_bd_intf_pin -mode Master -vlnv xilinx.com:interface:axis_rtl:1.0 M02_AXIS
create_bd_intf_pin -mode Slave -vlnv xilinx.com:interface:axis_rtl:1.0 S_AXIS
create_bd_pin -dir I -from 94 -to 0 Din
create_bd_pin -dir I -type clk dac_clk
create_bd_pin -dir I -from 0 -to 0 dac_control
create_bd_pin -dir I -type rst dac_resetn
create_bd_pin -dir I -type clk ddr4_clk
create_bd_pin -dir I -type rst ddr4_resetn

create_bd_cell -type ip -vlnv xilinx.com:ip:axis_broadcaster:1.1 axis_broadcaster_1
set_property -dict [list \
  CONFIG.M00_TDATA_REMAP {tdata[127:0]} \
  CONFIG.M01_TDATA_REMAP {tdata[127:0]} \
  CONFIG.M02_TDATA_REMAP {tdata[255:0]} \
  CONFIG.M03_TDATA_REMAP {tdata[7:0]} \
  CONFIG.M_TDATA_NUM_BYTES 16 \
  CONFIG.NUM_MI 2 \
  CONFIG.S_TDATA_NUM_BYTES 16 \
] [get_bd_cells axis_broadcaster_1]
create_bd_cell -type ip -vlnv xilinx.com:ip:axis_broadcaster:1.1 axis_broadcaster_2
set_property -dict [list \
  CONFIG.M00_TDATA_REMAP {tdata[63:0]} \
  CONFIG.M01_TDATA_REMAP {tdata[127:64]} \
  CONFIG.M02_TDATA_REMAP {tdata[255:0]} \
  CONFIG.M03_TDATA_REMAP {tdata[7:0]} \
  CONFIG.M_TDATA_NUM_BYTES 8 \
  CONFIG.NUM_MI 2 \
  CONFIG.S_TDATA_NUM_BYTES 16 \
] [get_bd_cells axis_broadcaster_2]
create_bd_cell -type ip -vlnv xilinx.com:ip:axis_data_fifo:2.0 axis_data_fifo_0
set_property -dict {CONFIG.FIFO_DEPTH 512} [get_bd_cells axis_data_fifo_0]
create_bd_cell -type ip -vlnv xilinx.com:ip:axis_data_fifo:2.0 axis_data_fifo_1
set_property -dict {CONFIG.FIFO_DEPTH 512 CONFIG.IS_ACLK_ASYNC 0} [get_bd_cells axis_data_fifo_1]
create_bd_cell -type ip -vlnv xilinx.com:ip:axis_data_fifo:2.0 axis_data_fifo_2
set_property -dict {CONFIG.FIFO_DEPTH 2048 CONFIG.IS_ACLK_ASYNC 0} [get_bd_cells axis_data_fifo_2]
create_bd_cell -type ip -vlnv xilinx.com:ip:axis_register_slice:1.1 axis_register_slice_0
create_bd_cell -type ip -vlnv xilinx.com:ip:util_vector_logic:2.0 control_tready
set_property -dict {CONFIG.C_SIZE 1} [get_bd_cells control_tready]
create_bd_cell -type ip -vlnv xilinx.com:ip:util_vector_logic:2.0 control_tvalid
set_property -dict {CONFIG.C_SIZE 1} [get_bd_cells control_tvalid]
create_bd_cell -type ip -vlnv user.org:user:adc_strm_mux:1.0 dac_strm_mux
set_property -dict {CONFIG.AXIS_TDATA_WIDTH 128 CONFIG.AXIS_TKEEP_WIDTH 16} [get_bd_cells dac_strm_mux]
create_bd_cell -type ip -vlnv xilinx.com:ip:xlslice:1.0 xlslice_0
set_property -dict {CONFIG.DIN_FROM 3 CONFIG.DIN_TO 3 CONFIG.DIN_WIDTH 95 CONFIG.DOUT_WIDTH 1} [get_bd_cells xlslice_0]
create_bd_cell -type ip -vlnv xilinx.com:ip:axis_register_slice:1.1 axis_register_slice_1
create_bd_cell -type ip -vlnv xilinx.com:ip:axis_clock_converter:1.1 axis_clock_converter_0
set_property -dict {CONFIG.HAS_TKEEP 1 CONFIG.HAS_TLAST 1 CONFIG.TDATA_NUM_BYTES 16} [get_bd_cells axis_clock_converter_0]

# ---- hierarchy /dac_path/soft_reset ----
current_bd_instance /dac_path/soft_reset
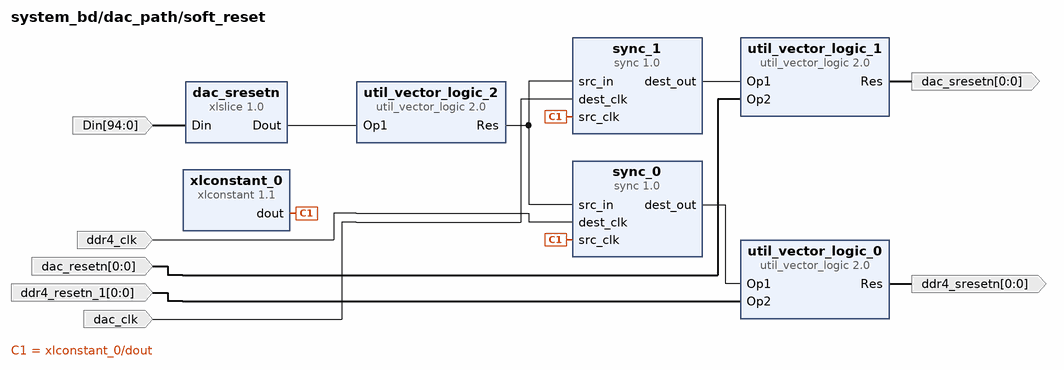
[diagram p7: block diagram inside /dac_path/soft_reset]
create_bd_pin -dir I -from 94 -to 0 Din
create_bd_pin -dir I -type clk dac_clk
create_bd_pin -dir I -from 0 -to 0 dac_resetn
create_bd_pin -dir O -from 0 -to 0 dac_sresetn
create_bd_pin -dir I -type clk ddr4_clk
create_bd_pin -dir I -from 0 -to 0 ddr4_resetn_1
create_bd_pin -dir O -from 0 -to 0 ddr4_sresetn

create_bd_cell -type ip -vlnv xilinx.com:ip:xlslice:1.0 dac_sresetn
set_property -dict {CONFIG.DIN_FROM 0 CONFIG.DIN_TO 0 CONFIG.DIN_WIDTH 95 CONFIG.DOUT_WIDTH 1} [get_bd_cells dac_sresetn]
create_bd_cell -type ip -vlnv xilinx.com:user:sync:1.0 sync_0
set_property -dict {CONFIG.SRC_INPUT_REG 0} [get_bd_cells sync_0]
create_bd_cell -type ip -vlnv xilinx.com:user:sync:1.0 sync_1
set_property -dict {CONFIG.SRC_INPUT_REG 0} [get_bd_cells sync_1]
create_bd_cell -type ip -vlnv xilinx.com:ip:util_vector_logic:2.0 util_vector_logic_0
set_property -dict {CONFIG.C_SIZE 1} [get_bd_cells util_vector_logic_0]
create_bd_cell -type ip -vlnv xilinx.com:ip:util_vector_logic:2.0 util_vector_logic_1
set_property -dict {CONFIG.C_SIZE 1} [get_bd_cells util_vector_logic_1]
create_bd_cell -type ip -vlnv xilinx.com:ip:util_vector_logic:2.0 util_vector_logic_2
set_property -dict {CONFIG.C_OPERATION not CONFIG.C_SIZE 1} [get_bd_cells util_vector_logic_2]
create_bd_cell -type ip -vlnv xilinx.com:ip:xlconstant:1.1 xlconstant_0
set_property -dict {CONFIG.CONST_VAL 0} [get_bd_cells xlconstant_0]

# ---- hierarchy /reset_block ----
current_bd_instance /reset_block
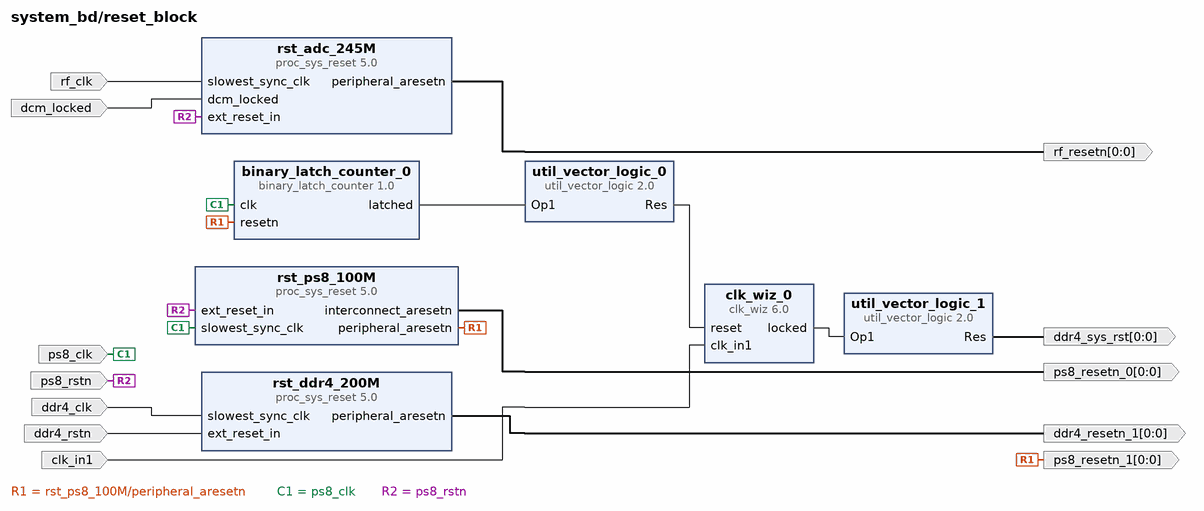
[diagram p8: block diagram inside /reset_block]
create_bd_pin -dir I -type clk clk_in1
create_bd_pin -dir I dcm_locked
create_bd_pin -dir I -type clk ddr4_clk
create_bd_pin -dir O -from 0 -to 0 -type rst ddr4_resetn_1
create_bd_pin -dir I -type rst ddr4_rstn
create_bd_pin -dir O -from 0 -to 0 ddr4_sys_rst
create_bd_pin -dir I -type clk ps8_clk
create_bd_pin -dir O -from 0 -to 0 -type rst ps8_resetn_0
create_bd_pin -dir O -from 0 -to 0 -type rst ps8_resetn_1
create_bd_pin -dir I -type rst ps8_rstn
create_bd_pin -dir I -type clk rf_clk
create_bd_pin -dir O -from 0 -to 0 -type rst rf_resetn

create_bd_cell -type ip -vlnv xilinx:user:binary_latch_counter:1.0 binary_latch_counter_0
create_bd_cell -type ip -vlnv xilinx.com:ip:clk_wiz:6.0 clk_wiz_0
set_property -dict [list \
  CONFIG.CLKIN1_JITTER_PS 50.0 \
  CONFIG.CLKOUT1_JITTER 92.799 \
  CONFIG.CLKOUT1_PHASE_ERROR 82.655 \
  CONFIG.CLKOUT1_REQUESTED_OUT_FREQ 200.000 \
  CONFIG.MMCM_CLKFBOUT_MULT_F 6.000 \
  CONFIG.MMCM_CLKIN1_PERIOD 5.000 \
  CONFIG.MMCM_CLKIN2_PERIOD 10.0 \
  CONFIG.MMCM_CLKOUT0_DIVIDE_F 6.000 \
  CONFIG.PRIM_IN_FREQ 200.000 \
  CONFIG.PRIM_SOURCE No_buffer \
] [get_bd_cells clk_wiz_0]
create_bd_cell -type ip -vlnv xilinx.com:ip:proc_sys_reset:5.0 rst_adc_245M
create_bd_cell -type ip -vlnv xilinx.com:ip:proc_sys_reset:5.0 rst_ddr4_200M
create_bd_cell -type ip -vlnv xilinx.com:ip:proc_sys_reset:5.0 rst_ps8_100M
create_bd_cell -type ip -vlnv xilinx.com:ip:util_vector_logic:2.0 util_vector_logic_0
set_property -dict {CONFIG.C_OPERATION not CONFIG.C_SIZE 1} [get_bd_cells util_vector_logic_0]
create_bd_cell -type ip -vlnv xilinx.com:ip:util_vector_logic:2.0 util_vector_logic_1
set_property -dict {CONFIG.C_OPERATION not CONFIG.C_SIZE 1} [get_bd_cells util_vector_logic_1]

# ---- connections ----

current_bd_instance /adc_path
connect_bd_intf_net [get_bd_intf_pins ADC0_AXIS] [get_bd_intf_pins axis_combiner_0/S00_AXIS]
connect_bd_intf_net [get_bd_intf_pins ADC1_AXIS] [get_bd_intf_pins axis_combiner_0/S01_AXIS]
connect_bd_intf_net [get_bd_intf_pins FLOW_AXI_LITE] [get_bd_intf_pins axis_flow_ctrl_0/S00_AXI]
connect_bd_intf_net [get_bd_intf_pins axi_dma_0/M_AXI_S2MM] [get_bd_intf_pins smartconnect_0/S00_AXI]
connect_bd_intf_net [get_bd_intf_pins axis_combiner_0/M_AXIS] [get_bd_intf_pins axis_flow_ctrl_0/s_axis]
connect_bd_intf_net [get_bd_intf_pins axi_dma_0/S_AXIS_S2MM] [get_bd_intf_pins mem/M_AXIS]
connect_bd_intf_net [get_bd_intf_pins axis_flow_ctrl_0/m_axis] [get_bd_intf_pins mem/S_AXIS]
connect_bd_intf_net [get_bd_intf_pins DMA_AXI_LITE] [get_bd_intf_pins axi_dma_0/S_AXI_LITE]
connect_bd_intf_net [get_bd_intf_pins PS_MEM_AXI] [get_bd_intf_pins smartconnect_0/M00_AXI]
connect_bd_intf_net [get_bd_intf_pins PL_MEM_AXI] [get_bd_intf_pins smartconnect_0/M01_AXI]
connect_bd_net [get_bd_pins Din] [get_bd_pins soft_reset/Din]
connect_bd_net -net aclk_1 [get_bd_pins adc_clk] \
  [get_bd_pins mem/adc_clk] [get_bd_pins soft_reset/adc_clk] [get_bd_pins axis_combiner_0/aclk] \
  [get_bd_pins axis_flow_ctrl_0/axis_aclk]
connect_bd_net [get_bd_pins adc_control] [get_bd_pins axis_flow_ctrl_0/adc_control]
connect_bd_net -net aresetn1_1 [get_bd_pins adc_resetn] [get_bd_pins soft_reset/adc_resetn]
connect_bd_net -net ddr4_0_c0_ddr4_ui_clk [get_bd_pins ddr4_clk] \
  [get_bd_pins mem/ddr4_clk] [get_bd_pins soft_reset/ddr4_clk] [get_bd_pins axi_dma_0/m_axi_s2mm_aclk] \
  [get_bd_pins smartconnect_0/aclk]
connect_bd_net -net dma_adc_0_s2mm_introut [get_bd_pins axi_dma_0/s2mm_introut] [get_bd_pins s2mm_introut]
connect_bd_net -net rst_ddr4_200M_peripheral_aresetn [get_bd_pins ddr4_resetn_1] \
  [get_bd_pins soft_reset/ddr4_resetn] [get_bd_pins smartconnect_0/aresetn]
connect_bd_net -net rst_ps8_100M_peripheral_aresetn [get_bd_pins ps8_resetn] \
  [get_bd_pins axi_dma_0/axi_resetn] [get_bd_pins axis_flow_ctrl_0/s00_axi_aresetn]
connect_bd_net -net soft_reset_Res [get_bd_pins soft_reset/ddr4_sresetn] [get_bd_pins mem/ddr4_resetn]
connect_bd_net -net util_vector_logic_1_Res [get_bd_pins soft_reset/adc_sresetn] \
  [get_bd_pins mem/adc_resetn] [get_bd_pins axis_combiner_0/aresetn] [get_bd_pins axis_flow_ctrl_0/axis_aresetn]
connect_bd_net [get_bd_pins xlconstant_0/dout] [get_bd_pins axi_dma_0/s_axis_s2mm_tkeep]
connect_bd_net -net zynq_ultra_ps_e_0_pl_clk0 [get_bd_pins ps8_clk] \
  [get_bd_pins axi_dma_0/s_axi_lite_aclk] [get_bd_pins axis_flow_ctrl_0/s00_axi_aclk]

current_bd_instance /adc_path/mem
connect_bd_intf_net [get_bd_intf_pins axis_clock_converter_0/M_AXIS] [get_bd_intf_pins axis_data_fifo_0/S_AXIS]
connect_bd_intf_net [get_bd_intf_pins M_AXIS] [get_bd_intf_pins axis_data_fifo_0/M_AXIS]
connect_bd_intf_net [get_bd_intf_pins S_AXIS] [get_bd_intf_pins axis_register_slice_0/S_AXIS]
connect_bd_intf_net [get_bd_intf_pins axis_clock_converter_0/S_AXIS] [get_bd_intf_pins axis_register_slice_0/M_AXIS]
connect_bd_net -net aclk_1 [get_bd_pins adc_clk] [get_bd_pins axis_clock_converter_0/s_axis_aclk] [get_bd_pins axis_register_slice_0/aclk]
connect_bd_net -net ddr4_0_c0_ddr4_ui_clk [get_bd_pins ddr4_clk] \
  [get_bd_pins axis_clock_converter_0/m_axis_aclk] [get_bd_pins axis_data_fifo_0/s_axis_aclk]
connect_bd_net [get_bd_pins ddr4_resetn] [get_bd_pins axis_clock_converter_0/m_axis_aresetn] [get_bd_pins axis_data_fifo_0/s_axis_aresetn]
connect_bd_net -net util_vector_logic_1_Res [get_bd_pins adc_resetn] \
  [get_bd_pins axis_clock_converter_0/s_axis_aresetn] [get_bd_pins axis_register_slice_0/aresetn]

current_bd_instance /adc_path/soft_reset
connect_bd_net [get_bd_pins Din] [get_bd_pins xlslice_0/Din]
connect_bd_net -net aclk_1 [get_bd_pins adc_clk] [get_bd_pins sync_0/dest_clk]
connect_bd_net [get_bd_pins ddr4_clk] [get_bd_pins sync_1/dest_clk]
connect_bd_net -net ddr4_resetn_1_1 [get_bd_pins ddr4_resetn] [get_bd_pins util_vector_logic_3/Op2]
connect_bd_net -net rst_ps8_100M_peripheral_aresetn [get_bd_pins adc_resetn] [get_bd_pins util_vector_logic_4/Op2]
connect_bd_net [get_bd_pins sync_0/dest_out] [get_bd_pins util_vector_logic_4/Op1]
connect_bd_net [get_bd_pins sync_1/dest_out] [get_bd_pins util_vector_logic_3/Op1]
connect_bd_net [get_bd_pins util_vector_logic_0/Res] [get_bd_pins sync_0/src_in] [get_bd_pins sync_1/src_in]
connect_bd_net [get_bd_pins util_vector_logic_3/Res] [get_bd_pins ddr4_sresetn]
connect_bd_net [get_bd_pins util_vector_logic_4/Res] [get_bd_pins adc_sresetn]
connect_bd_net [get_bd_pins xlconstant_0/dout] [get_bd_pins sync_0/src_clk] [get_bd_pins sync_1/src_clk]
connect_bd_net [get_bd_pins xlslice_0/Dout] [get_bd_pins util_vector_logic_0/Op1]

current_bd_instance /clocktreeMTS
connect_bd_intf_net [get_bd_intf_pins s_axi_lite] [get_bd_intf_pins clk_wiz_0/s_axi_lite]
connect_bd_intf_net [get_bd_intf_pins lmk_clk2] [get_bd_intf_pins IBUFDS_SYSREF/CLK_IN_D]
connect_bd_intf_net [get_bd_intf_pins lmk_clk1] [get_bd_intf_pins IBUFDS_PL_CLK/CLK_IN_D]
connect_bd_intf_net [get_bd_intf_pins sys_clk_ddr4] [get_bd_intf_pins IBUFDS_DDR4/CLK_IN_D]
connect_bd_net [get_bd_pins BUFG_DDR4/BUFG_O] [get_bd_pins ddr_clk]
connect_bd_net [get_bd_pins BUFG_PL_CLK/BUFG_O] [get_bd_pins clk_wiz_0/clk_in1] [get_bd_pins sync_3/dest_clk]
connect_bd_net [get_bd_pins Din] [get_bd_pins adc_control/Din] [get_bd_pins dac_control/Din]
connect_bd_net [get_bd_pins IBUFDS_DDR4/IBUF_OUT] [get_bd_pins BUFG_DDR4/BUFG_I]
connect_bd_net [get_bd_pins IBUFDS_PL_CLK/IBUF_OUT] [get_bd_pins BUFG_PL_CLK/BUFG_I]
connect_bd_net [get_bd_pins IBUFDS_SYSREF/IBUF_OUT] [get_bd_pins sync_3/src_in]
connect_bd_net [get_bd_pins adc_control/Dout] [get_bd_pins sync_0/src_in]
connect_bd_net [get_bd_pins clk_wiz_0/clk_out1] [get_bd_pins sync_0/dest_clk] [get_bd_pins sync_1/dest_clk]
connect_bd_net [get_bd_pins clk_wiz_0/clk_out2] [get_bd_pins rf_clk] [get_bd_pins sync_2/dest_clk]
connect_bd_net [get_bd_pins clk_wiz_0/interrupt] [get_bd_pins interrupt]
connect_bd_net [get_bd_pins clk_wiz_0/locked] [get_bd_pins locked]
connect_bd_net [get_bd_pins dac_control/Dout] [get_bd_pins sync_1/src_in]
connect_bd_net [get_bd_pins s_axi_aclk] [get_bd_pins clk_wiz_0/s_axi_aclk] [get_bd_pins clk_wiz_0/ref_clk]
connect_bd_net [get_bd_pins s_axi_aresetn] [get_bd_pins clk_wiz_0/s_axi_aresetn]
connect_bd_net [get_bd_pins sync_0/dest_out] [get_bd_pins adc_control]
connect_bd_net [get_bd_pins sync_1/dest_out] [get_bd_pins dac_control]
connect_bd_net [get_bd_pins sync_2/dest_out] [get_bd_pins user_sysref]
connect_bd_net [get_bd_pins sync_3/dest_out] [get_bd_pins sync_2/src_in]
connect_bd_net [get_bd_pins xlconstant_0/dout] \
  [get_bd_pins sync_0/src_clk] [get_bd_pins sync_1/src_clk] [get_bd_pins sync_2/src_clk] [get_bd_pins sync_3/src_clk]

current_bd_instance /dac_path
connect_bd_intf_net [get_bd_intf_pins DAC0_AXIS] [get_bd_intf_pins mem/M01_AXIS]
connect_bd_intf_net [get_bd_intf_pins DAC1_AXIS] [get_bd_intf_pins mem/M02_AXIS]
connect_bd_intf_net [get_bd_intf_pins axi_dma_0/M_AXI_MM2S] [get_bd_intf_pins smartconnect_0/S00_AXI]
connect_bd_intf_net [get_bd_intf_pins axi_dma_0/M_AXIS_MM2S] [get_bd_intf_pins mem/S_AXIS]
connect_bd_intf_net [get_bd_intf_pins S_AXI_LITE] [get_bd_intf_pins axi_dma_0/S_AXI_LITE]
connect_bd_intf_net [get_bd_intf_pins PS_MEM_AXI] [get_bd_intf_pins smartconnect_0/M00_AXI]
connect_bd_intf_net [get_bd_intf_pins PL_MEM_AXI] [get_bd_intf_pins smartconnect_0/M01_AXI]
connect_bd_net [get_bd_pins Din] [get_bd_pins mem/Din] [get_bd_pins soft_reset/Din]
connect_bd_net -net Op2_1 [get_bd_pins dac_control] [get_bd_pins mem/dac_control]
connect_bd_net [get_bd_pins dac_resetn] [get_bd_pins soft_reset/dac_resetn]
connect_bd_net -net ddr4_0_c0_ddr4_ui_clk [get_bd_pins ddr4_clk] \
  [get_bd_pins mem/ddr4_clk] [get_bd_pins soft_reset/ddr4_clk] [get_bd_pins axi_dma_0/m_axi_mm2s_aclk] \
  [get_bd_pins smartconnect_0/aclk]
connect_bd_net -net dma_dac_0_mm2s_introut [get_bd_pins axi_dma_0/mm2s_introut] [get_bd_pins mm2s_introut]
connect_bd_net -net m_axis_aclk_1 [get_bd_pins dac_clk] [get_bd_pins mem/dac_clk] [get_bd_pins soft_reset/dac_clk]
connect_bd_net -net rst_ddr4_200M_peripheral_aresetn [get_bd_pins ddr4_resetn_1] \
  [get_bd_pins soft_reset/ddr4_resetn_1] [get_bd_pins smartconnect_0/aresetn]
connect_bd_net -net rst_ps8_100M_peripheral_aresetn [get_bd_pins ps8_resetn] [get_bd_pins axi_dma_0/axi_resetn]
connect_bd_net -net util_vector_logic_0_Res [get_bd_pins soft_reset/dac_sresetn] [get_bd_pins mem/dac_resetn]
connect_bd_net -net util_vector_logic_1_Res [get_bd_pins soft_reset/ddr4_sresetn] [get_bd_pins mem/ddr4_resetn]
connect_bd_net -net zynq_ultra_ps_e_0_pl_clk0 [get_bd_pins ps8_clk] [get_bd_pins axi_dma_0/s_axi_lite_aclk]

current_bd_instance /dac_path/mem
connect_bd_intf_net [get_bd_intf_pins S_AXIS] [get_bd_intf_pins axis_register_slice_1/S_AXIS]
connect_bd_intf_net [get_bd_intf_pins axis_broadcaster_1/M00_AXIS] [get_bd_intf_pins axis_data_fifo_0/S_AXIS]
connect_bd_intf_net [get_bd_intf_pins axis_broadcaster_1/M01_AXIS] [get_bd_intf_pins axis_broadcaster_2/S_AXIS]
connect_bd_intf_net [get_bd_intf_pins M01_AXIS] [get_bd_intf_pins axis_broadcaster_2/M00_AXIS]
connect_bd_intf_net [get_bd_intf_pins M02_AXIS] [get_bd_intf_pins axis_broadcaster_2/M01_AXIS]
connect_bd_intf_net [get_bd_intf_pins axis_clock_converter_0/M_AXIS] [get_bd_intf_pins axis_data_fifo_1/S_AXIS]
connect_bd_intf_net [get_bd_intf_pins axis_data_fifo_0/M_AXIS] [get_bd_intf_pins dac_strm_mux/s1_axi_stream]
connect_bd_intf_net [get_bd_intf_pins axis_data_fifo_1/M_AXIS] [get_bd_intf_pins dac_strm_mux/s0_axi_stream]
connect_bd_intf_net [get_bd_intf_pins axis_data_fifo_2/M_AXIS] [get_bd_intf_pins axis_register_slice_0/S_AXIS]
connect_bd_intf_net [get_bd_intf_pins axis_broadcaster_1/S_AXIS] [get_bd_intf_pins axis_register_slice_0/M_AXIS]
connect_bd_intf_net [get_bd_intf_pins axis_register_slice_1/M_AXIS] [get_bd_intf_pins axis_clock_converter_0/S_AXIS]
connect_bd_intf_net [get_bd_intf_pins axis_data_fifo_2/S_AXIS] [get_bd_intf_pins dac_strm_mux/m0_axi_stream]
connect_bd_net [get_bd_pins Din] [get_bd_pins xlslice_0/Din]
connect_bd_net -net Op2_1 [get_bd_pins dac_control] [get_bd_pins control_tready/Op2] [get_bd_pins control_tvalid/Op2]
connect_bd_net [get_bd_pins axis_broadcaster_1/s_axis_tready] [get_bd_pins control_tready/Op1]
connect_bd_net [get_bd_pins axis_register_slice_0/m_axis_tvalid] [get_bd_pins control_tvalid/Op1]
connect_bd_net -net ddr4_0_c0_ddr4_ui_clk [get_bd_pins ddr4_clk] \
  [get_bd_pins axis_register_slice_1/aclk] [get_bd_pins axis_clock_converter_0/s_axis_aclk]
connect_bd_net -net m_axis_aclk_1 [get_bd_pins dac_clk] \
  [get_bd_pins axis_broadcaster_1/aclk] [get_bd_pins axis_broadcaster_2/aclk] [get_bd_pins axis_data_fifo_0/s_axis_aclk] \
  [get_bd_pins axis_data_fifo_2/s_axis_aclk] [get_bd_pins axis_register_slice_0/aclk] [get_bd_pins dac_strm_mux/s_axis_aclk] \
  [get_bd_pins axis_clock_converter_0/m_axis_aclk] [get_bd_pins axis_data_fifo_1/s_axis_aclk]
connect_bd_net -net util_vector_logic_0_Res [get_bd_pins dac_resetn] \
  [get_bd_pins axis_broadcaster_1/aresetn] [get_bd_pins axis_broadcaster_2/aresetn] \
  [get_bd_pins axis_data_fifo_0/s_axis_aresetn] [get_bd_pins axis_data_fifo_2/s_axis_aresetn] \
  [get_bd_pins axis_register_slice_0/aresetn] [get_bd_pins axis_clock_converter_0/m_axis_aresetn] \
  [get_bd_pins axis_data_fifo_1/s_axis_aresetn]
connect_bd_net -net util_vector_logic_0_Res1 [get_bd_pins control_tready/Res] [get_bd_pins axis_register_slice_0/m_axis_tready]
connect_bd_net -net util_vector_logic_1_Res [get_bd_pins ddr4_resetn] \
  [get_bd_pins axis_clock_converter_0/s_axis_aresetn] [get_bd_pins axis_register_slice_1/aresetn]
connect_bd_net -net util_vector_logic_1_Res1 [get_bd_pins control_tvalid/Res] [get_bd_pins axis_broadcaster_1/s_axis_tvalid]
connect_bd_net [get_bd_pins xlslice_0/Dout] [get_bd_pins dac_strm_mux/mux_select]
